# EAGLE schematic HP_Delta_DPS-600WB_A (EAGLE 6.4)
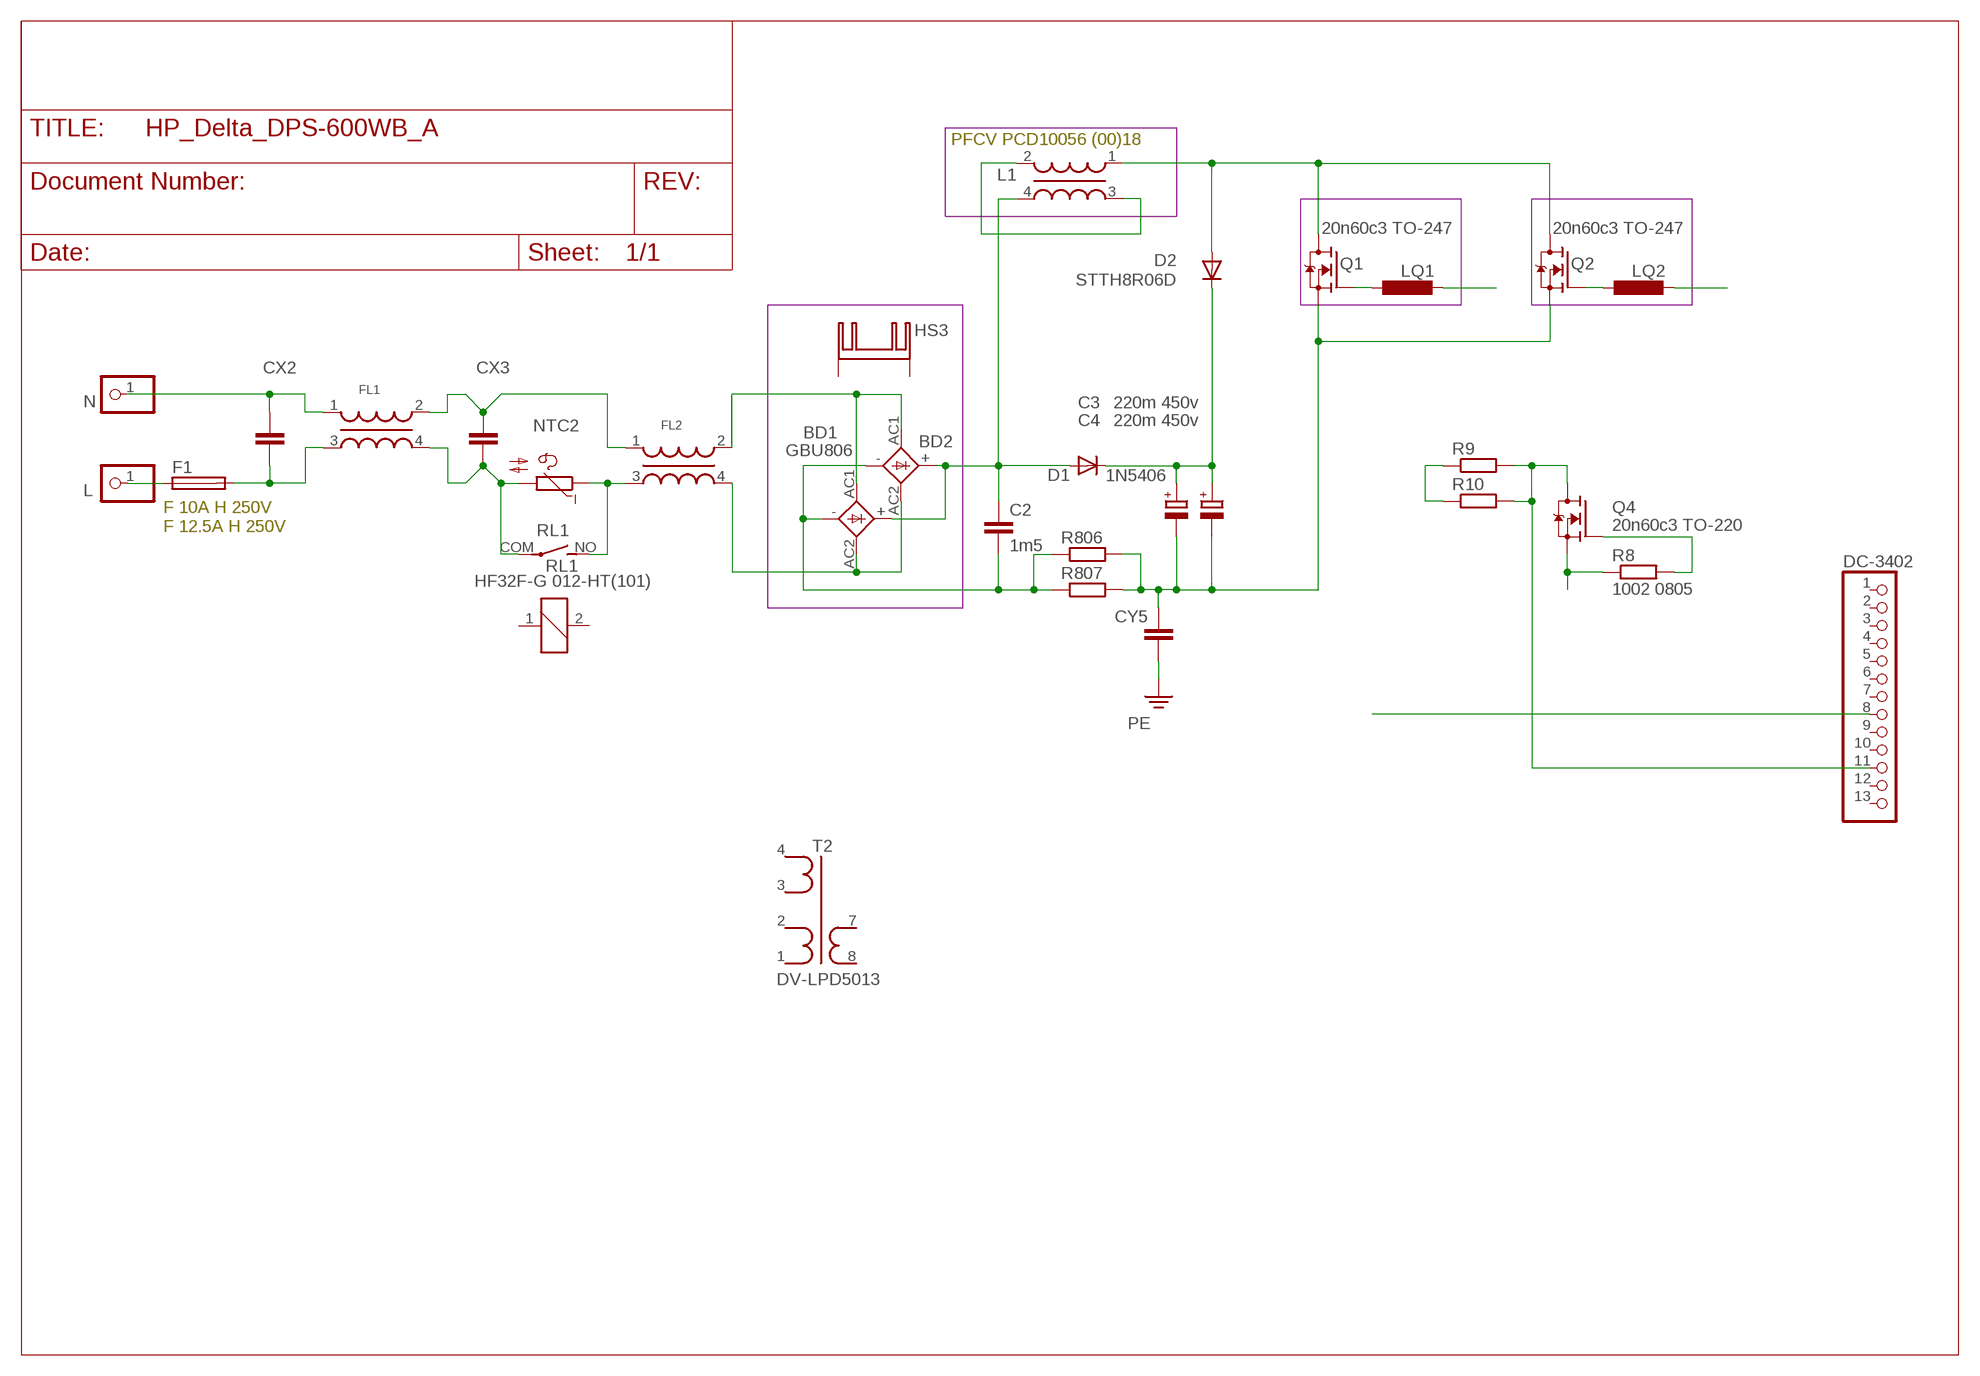
[diagram p0: schematic, sheet 1]

## Parts
BD1  GBU806  2KBB-R  [2KBB-R]
BD2  2KBB-R  [2KBB-R]
C2  1m5  C-EU150-072X183  [C150-072X183]
C3  220m 450v  CPOL-EUSANYO_E7  [SANYO-OSCON_E7]
C4  220m 450v  CPOL-EUSANYO_E7  [SANYO-OSCON_E7]
CX2  C-EU150-072X183  [C150-072X183]
CX3  C-EU150-072X183  [C150-072X183]
CY5  C-EU025-040X050  [C025-040X050]
D1  1N5406  1N4942  [DO41-10]
D2  STTH8R06D  BYT85  [DO220S]
DC-3402  PINHD-1X13  [1X13]
F1  19560  [19560]
FL1  LFLF-10X13  [LF-10X13]
FL2  LFLF-10X13  [LF-10X13]
HS3  FK222  [FK222]
L  PINHD-1X1  [1X01]
L1  PFCV PCD10056 (00)18  LFLF-10X13  [LF-10X13]
LQ1  L-EU0204/5  [0204/5]
LQ2  L-EU0204/5  [0204/5]
N  PINHD-1X1  [1X01]
NTC2  B57164  [B57164]
Q1  20n60c3 TO-247  SPW47N60S5  [P-TO247]
Q2  20n60c3 TO-247  SPW47N60S5  [P-TO247]
Q4  20n60c3 TO-220  SPW47N60S5  [P-TO247]
R8  1002 0805  R-EU_R0805  [R0805]
R9  R-EU_0204/7  [0204/7]
R10  R-EU_0204/7  [0204/7]
R806  R-EU_0309/12  [0309/12]
R807  R-EU_0309/12  [0309/12]
RL1  HF32F-G 012-HT(101)  APF30212A  [APF30212A]
T2  DV-LPD5013  [DV-LPD5013]

## Nets
N$1: BD1.AC1 BD2.AC1 FL2.2
N$2: BD1.AC2 BD2.AC2 FL2.4
N$4: LQ1.1 Q1.1(G)
N$5: CX3.1 FL1.2 FL2.1
N$6: FL2.3 NTC2.1 RL1.NO(2:S)
N$7: CX3.2 FL1.4 NTC2.2 RL1.COM(2:P)
N$8: CX2.2 F1.2 FL1.3
N$9: CX2.1 FL1.1 N.1
N$10: F1.1 L.1
N$12: L1.2 L1.3
N$13: DC-3402.8
N$14: LQ1.2
N$15: C3.+ C4.+ D1.C D2.C
N$16: D2.A L1.1 Q1.2(D) Q2.2(D)
N$17: LQ2.1 Q2.1(G)
N$18: LQ2.2
N$20: C3.- C4.- CY5.1 Q1.3(S) Q2.3(S) R806.2 R807.2
N$21: Q4.1(G) R8.2
N$22: DC-3402.11 Q4.2(D) R9.2 R10.2
N$23: Q4.3(S) R8.1
N$24: BD1.+ BD2.+ C2.1 D1.A L1.4
N$25: BD1.- BD2.- C2.2 R806.1 R807.1
N$26: R9.1 R10.1
PE: CY5.2
Unconnected: DC-3402.1 DC-3402.2 DC-3402.3 DC-3402.4 DC-3402.5 DC-3402.6 DC-3402.7 DC-3402.9 DC-3402.10 DC-3402.12 DC-3402.13 HS3.A2,8(K) HS3.B2,8(K) RL1.1 RL1.2 T2.1 T2.2 T2.3 T2.4 T2.7 T2.8

## Notes on the sheet
- PFCV PCD10056 (00)18
- F 10A H 250V
  F 12.5A H 250V

## Library data of the parts
BD1 BD2 = rectifier:2KBB-R: RECTIFIER grid 3 x 5 mm
C2 CX2 CX3 CY5 = rcl:C-EU: CAPACITOR, European symbol
C3 C4 = rcl:CPOL-EU: POLARIZED CAPACITOR, European symbol
D1 = diode:1N4942: DIODE 1.0 A, 200 V, 150 ns
D2 = diode:BYT85: DIODE
DC-3402 = pinhead:PINHD-1X13: PIN HEADER
F1 = fuse:19560: FUSE HOLDER TR5, Wickmann; MPN: 56000001009; OC_FARNELL: 1185363; OC_NEWARK: 15P8392
FL1 FL2 L1 = DSS0:LF
HS3 = heatsink:FK222: HEATSINK manufacturer Fischer/distributor Buerklin
L N = pinhead:PINHD-1X1: PIN HEADER
LQ1 LQ2 = rcl:L-EU: INDUCTOR, European symbol
NTC2 = ptc-ntc:B57164: SIEMENS NTC; MPN: B57164K474K52; OC_FARNELL: 9753451; OC_NEWARK: 29M3118
Q1 Q2 Q4 = transistor-fet:SPW47N60S5: Cool MOS Power Transistor
R8-R10 R806 R807 = rcl:R-EU_: RESISTOR, European symbol
RL1 = relay:APF30212A: Compliant with European standards 1a/1c 6A Slim power relays Source: Data sheet <http://pewa.panasonic.com/assets/pcsd/catalog/pf-catalog.pdf>; OC_FARNELL: unknown
T2 = DPS-600WP:DV-LPD5013